# EAGLE design uart2dali_mr3020_3 (EAGLE 6.4)
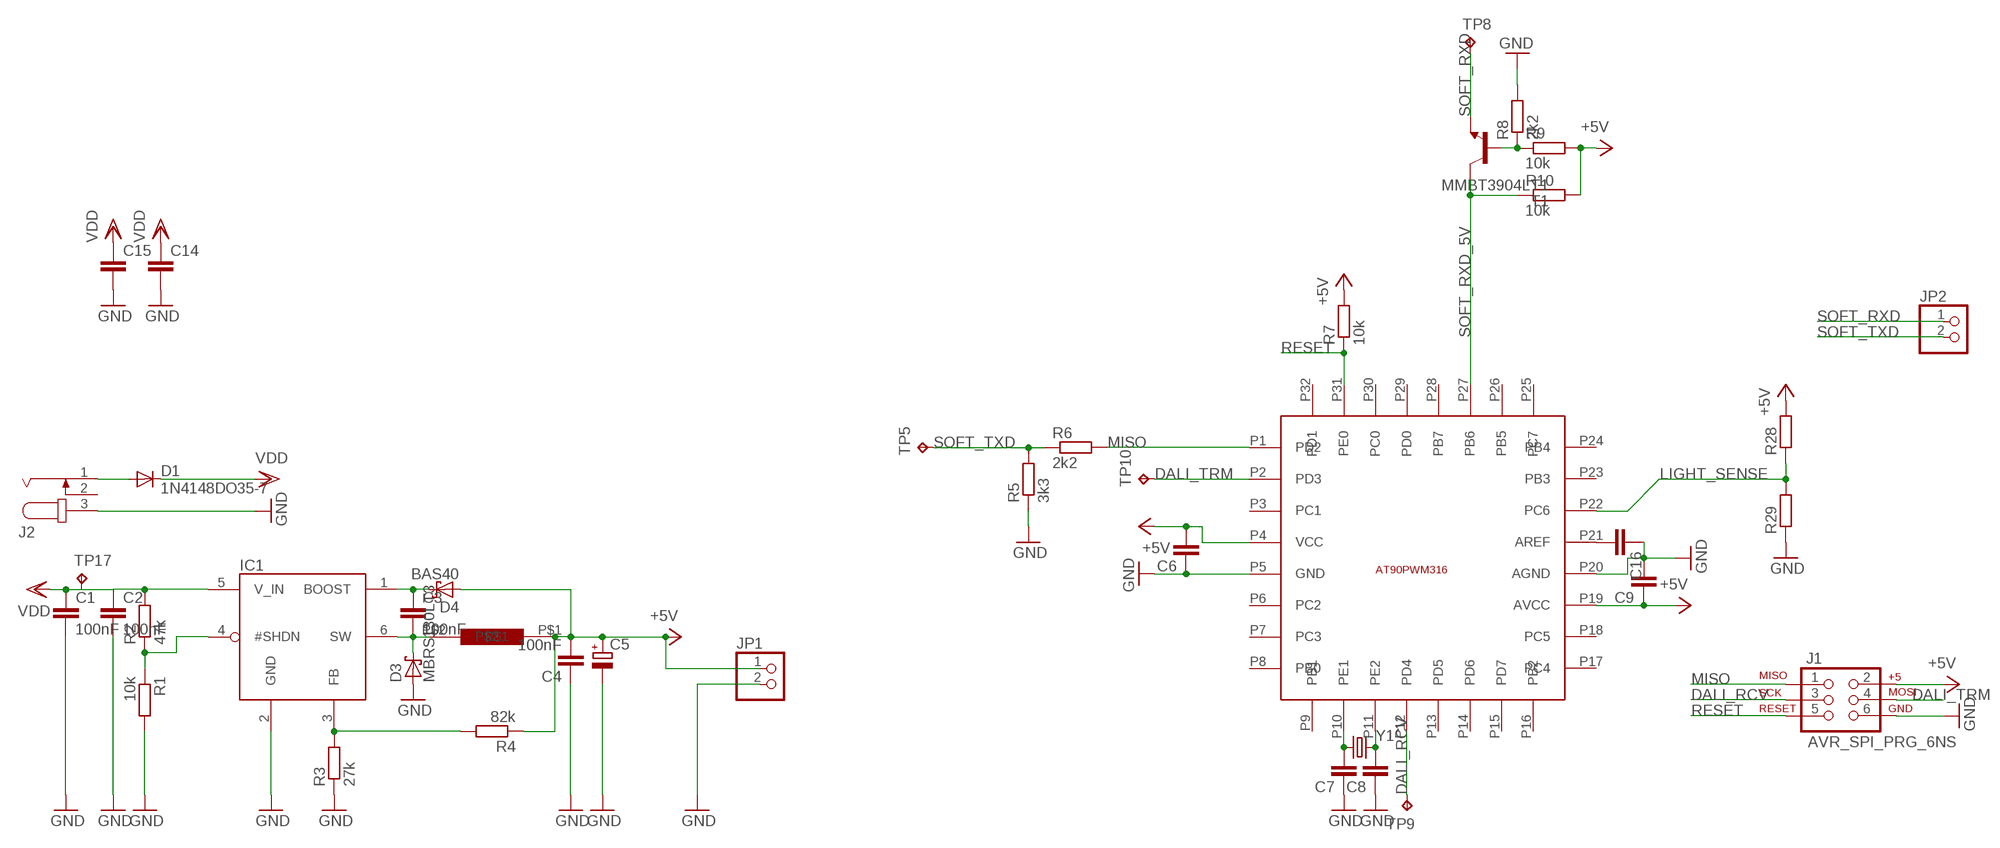
[diagram p0: schematic, sheet 1, part 1 of 2]
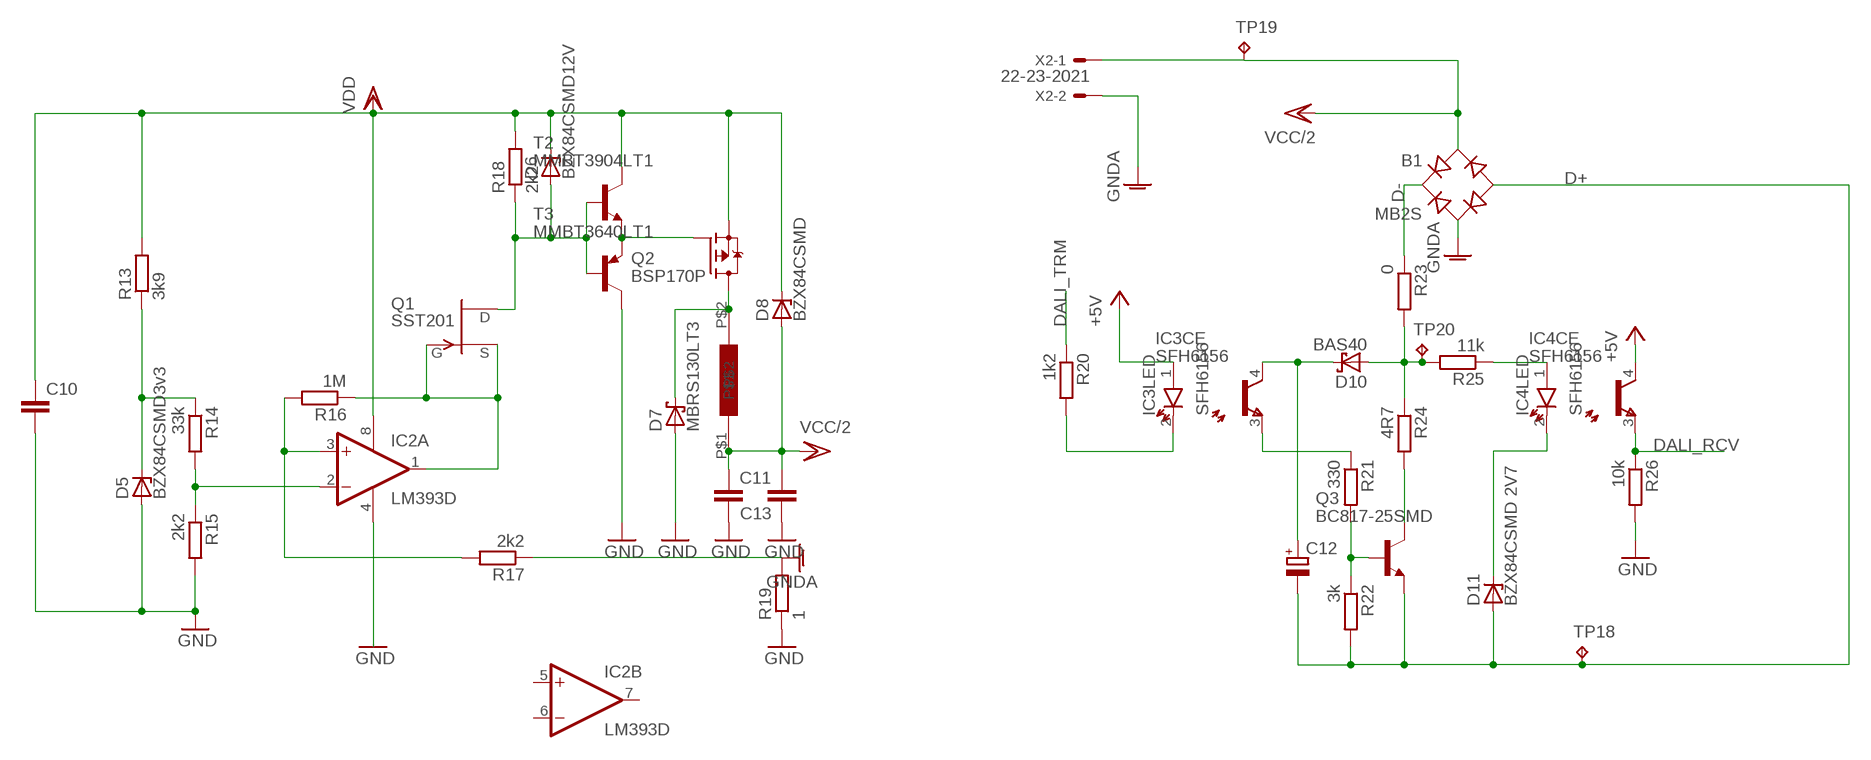
[diagram p1: schematic, sheet 1, part 2 of 2]

## Parts
B1  MB2S  [SOIC-4]
C1  100nF  C-EUC0805  [C0805]
C2  100nF  C-EUC0805  [C0805]
C3  100nF  C-EUC0805  [C0805]
C4  100nF  C-EUC0805  [C0805]
C5  CPOL-EUCT7343  [CT7343]
C6  C-EUC0603  [C0603]
C7  C-EUC0603  [C0603]
C8  C-EUC0603  [C0603]
C9  C-EUC0603  [C0603]
C10  C-EUC0603  [C0603]
C11  C-EUC0805  [C0805]
C12  CPOL-EUCT6032  [CT6032]
C13  C-EUC0805  [C0805]
C14  C-EUC0805  [C0805]
C15  C-EUC0805  [C0805]
C16  C-EUC0603  [C0603]
D1  1N4148DO35-7  [DO35-7]
D3  MBRS130LT3  [SMB]
D4  BAS40  [SOT23]
D5  BZX84CSMD3v3  BZX84CSMD  [TO236]
D6  BZX84CSMD12V  BZX84CSMD  [TO236]
D7  MBRS130LT3  [SMB]
D8  BZX84CSMD  [TO236]
D10  BAS40  [SOT23]
D11  BZX84CSMD 2V7  BZX84CSMD  [TO236]
IC1  LT1933ES6  [SOT23-6]
IC2  LM393D  [SO08]
IC3  SFH6156  [SFH]
IC4  SFH6156  [SFH]
J1  AVR_SPI_PRG_6NS  [2X3-NS]
J2  JACK-PLUG1  [SPC4078]
JP1  PINHD-1X2  [1X02]
JP2  PINHD-1X2  [1X02]
Q1  SST201  [SOT23]
Q2  BSP170P  [SOT223]
Q3  BC817-25SMD  [SOT23-BEC]
R1  10k  R-EU_R0603  [R0603]
R2  47k  R-EU_R0603  [R0603]
R3  27k  R-EU_R0603  [R0603]
R4  82k  R-EU_R0603  [R0603]
R5  3k3  R-EU_R0603  [R0603]
R6  2k2  R-EU_R0603  [R0603]
R7  10k  R-EU_R0603  [R0603]
R8  2k2  R-EU_R0603  [R0603]
R9  10k  R-EU_R0603  [R0603]
R10  10k  R-EU_R0603  [R0603]
R13  3k9  R-EU_R0603  [R0603]
R14  33k  R-EU_R0603  [R0603]
R15  2k2  R-EU_R0603  [R0603]
R16  1M  R-EU_R0603  [R0603]
R17  2k2  R-EU_R0603  [R0603]
R18  2k2  R-EU_R0603  [R0603]
R19  1  R-EU_R0603  [R0603]
R20  1k2  R-EU_R0603  [R0603]
R21  330  R-EU_R0603  [R0603]
R22  3k  R-EU_R0603  [R0603]
R23  0  R-EU_R0603  [R0603]
R24  4R7  R-EU_R0603  [R0603]
R25  11k  R-EU_R0603  [R0603]
R26  10k  R-EU_R0603  [R0603]
R28  R-EU_0207/2V  [0207/2V]
R29  R-EU_R0603  [R0603]
T1  MMBT3904LT1  MMBT3904LT1-NPN-SOT23-BEC  [SOT23-BEC]
T2  MMBT3904LT1  MMBT3904LT1-NPN-SOT23-BEC  [SOT23-BEC]
T3  MMBT3640LT1  MMBT3640LT1-PNP-SOT23-BEC  [SOT23-BEC]
TP5  TPB1,27  [B1,27]
TP8  TPB1,27  [B1,27]
TP9  TPB1,27  [B1,27]
TP10  TPB1,27  [B1,27]
TP17  TPB1,27  [B1,27]
TP18  TPB1,27  [B1,27]
TP19  TPB1,27  [B1,27]
TP20  TPB1,27  [B1,27]
U$1  KMP_2330_UNSHIELDED 33uH  KMP_2330_UNSHIELDED  [KMP_2330_UNSHIELDED]
U$2  AT90PWM316  [QFN32_7MM]
U$3  SDR0805  [SDR0805]
X2  22-23-2021  [22-23-2021]
Y1  CRYSTALTXC-7A  [CRYSTAL-TXC-7A]

## Nets
+5V: C4.2 C5.+ C6.2 C9.1 D4.1(A) IC3.1(LED:A) IC4.4(CE:C) J1.2 JP1.1 R4.1 R7.2 R9.2 R10.2 R28.2 U$1.P$1 U$2.P4(VCC) U$2.P19(AVCC)
D+: B1.- C12.- D11.A Q3.E R22.2 TP18.TP
D-: B1.+ R23.1
DALI_RCV: J1.3 TP9.TP U$2.P12(PD4)
DALI_TRM: J1.4 R20.1 TP10.TP U$2.P2(PD3)
GND: C1.2 C2.2 C4.1 C5.- C6.1 C7.1 C8.1 C9.2 C10.2 C11.2 C13.1 C14.2 C15.2 C16.1 D3.A D5.A D7.A IC1.2(GND) IC2.4(P:V-) J1.6 J2.3 JP1.2 R1.2 R3.1 R5.1 R8.2 R15.2 R19.1 R26.2 R29.1 T3.C U$2.P5(GND) U$2.P20(AGND)
GNDA: B1.~2(AC2) R17.1 R19.2 X2.2
LIGHT_SENSE: R28.1 R29.2 U$2.P22(PC6)
MISO: J1.1 R6.2 U$2.P1(PD2)
N$1: IC3.2(LED:K) R20.2
N$2: IC2.2(A:-IN) R14.2 R15.1
N$3: IC1.4(#SHDN) R1.1 R2.1
N$4: C12.+ D10.3(C) IC3.4(CE:C)
N$5: IC3.3(CE:E) R21.1
N$6: Q3.B R21.2 R22.1
N$7: IC4.3(CE:E) R26.1
N$8: C16.2 U$2.P21(AREF)
N$9: D10.1(A) R23.2 R24.1 R25.2 TP20.TP
N$10: Q3.C R24.2
N$11: IC4.1(LED:A) R25.1
N$12: D11.C IC4.2(LED:K)
N$16: C7.2 U$2.P10(PE1) Y1.P$1
N$19: C8.2 U$2.P11(PE2) Y1.P$2
N$20: R8.1 R9.1 T1.B
N$22: IC2.1(A:OUT) Q1.2(S) Q1.3(G) R16.1
N$23: D1.A J2.1
N$24: C3.1 D4.3(C) IC1.1(BOOST)
N$25: C3.2 D3.C IC1.6(SW) U$1.P$2
N$26: D7.C Q2.2(D) Q2.4(D) U$3.P$2
N$31: IC1.3(FB) R3.2 R4.2
N$33: Q2.1(G) T2.E T3.E
N$34: D6.A Q1.1(D) R18.1 T2.B T3.B
N$35: D5.C R13.1 R14.1
N$40: IC2.3(A:+IN) R16.2 R17.2
RESET: J1.5 R7.1 U$2.P31(PE0)
SOFT_RXD: JP2.1 T1.E TP8.TP
SOFT_RXD_5V: R10.1 T1.C U$2.P27(PB6)
SOFT_TXD: JP2.2 R5.2 R6.1 TP5.TP
VCC/2: B1.~1(AC1) C11.1 C13.2 D8.A TP19.TP U$3.P$1 X2.1
VDD: C1.1 C2.1 C10.1 C14.1 C15.1 D1.C D6.C D8.C IC1.5(V_IN) IC2.8(P:V+) Q2.3(S) R2.2 R13.2 R18.2 T2.C TP17.TP
Unconnected: IC2.5(B:+IN) IC2.6(B:-IN) IC2.7(B:OUT) J2.2 U$2.P3(PC1) U$2.P6(PC2) U$2.P7(PC3) U$2.P8(PB0) U$2.P9(PB1) U$2.P13(PD5) U$2.P14(PD6) U$2.P15(PD7) U$2.P16(PB2) U$2.P17(PC4) U$2.P18(PC5) U$2.P23(PB3) U$2.P24(PB4) U$2.P25(PC7) U$2.P26(PB5) U$2.P28(PB7) U$2.P29(PD0) U$2.P30(PC0) U$2.P32(PD1)

## Library data of the parts
B1 = rectifier:MB*S: Bridge Rectifier Source: http://www.fairchildsemi.com/ds/MB/MB6S.pdf
C1-C4 C6-C11 C13-C16 = resistor:C-EU: CAPACITOR, European symbol
C5 C12 = resistor:CPOL-EU: POLARIZED CAPACITOR, European symbol
D1 = diode:1N4148: DIODE high speed (Philips)
D3 D7 = diode:MBRS130LT3: Schottky Power Rectifier Source: http://www.onsemi.com/pub/Collateral/MBRS130LT3-D.PDF
D4 D10 = diode:BAS40: Silicon Schottky Diodes General-purpose diode for high-speed switching
D5 D6 D8 D11 = diode:BZX84CSMD: Z DIODE
IC1 = ltc_swr:LT1933: LT1933 - 600mA, 500kHz Step-Down Switching Regulator in SOT-23 Wide Input Range: 3.6V to 36V 5V at 600mA from 16V to 36V Input 3.3V at 600mA from 12V to 36V Input 5V at 500mA from 6.3V to 36V Input 3.3V at 500mA from 4.5V to 36V Input Fixed Frequency 500kHz Operation Uses Tiny Capacitors and Inductors Soft-Start Internally Compensated Low Shutdown Current: <2µA Output Adjustable Down to 1.25V Low Profile (1mm) SOT-23 (ThinSOT™) and (2mm x 3mm x 0.75mm) 6-Pin DFN Packages
IC2 = linear:LM393: COMPARATOR
IC3 IC4 = optocoupler:SFH6156: 5.3 kV TRIOS High Reliability Optocoupler; MF: VISHAY/TELEFUNKEN; MPN: SFH6156-4T; OC_FARNELL: 1612479; OC_NEWARK: 21H7733
J1 = SparkFun-Connectors:AVR_SPI_PRG_6: AVR ISP 6 Pin This is the reduced ISP connector for AVR programming. Common on Arduino. This footprint will take up less PCB space and can be used with a 10-pin to 6-pin adapter such as SKU: BOB-08508
J2 = con-jack:JACK-PLUG: DC POWER JACK Power Jack, DC, Right Angle, Through Hole, Rated 5A at 16VDC, PC Terminals Distributor: Farnell (www.Farnell.de) Drawing: 84N1161.pdf / 84N1162.pdf Manufacturer: SPC Technology (www.spctechnology.com) Type: SPC4077 / SPC 4078; OC_FARNELL: unknown; OC_NEWARK: unknown
JP1 JP2 = pinhead:PINHD-1X2: PIN HEADER
Q1 = transistor-fet:?20*: TEMIC / Siliconix N-Channel JFET Source: JFET-J201_Siliconix_data.pdf
Q2 = transistor-fet:BSP170P: SIPMOS(R) Small-Signal-Transistor P-Channel, Enhancement mode Source: http://www.infineon.com/upload/Document/BSP170P_Rev2.4.pdf
Q3 = transistor-npn:BC817*: NPN Transistor
R1-R10 R13-R26 R28 R29 = resistor:R-EU_: RESISTOR, European symbol
T1 T2 = transistor:*-NPN-: NPN Transistror BF959 corrected 2008.03.06
T3 = transistor:*-PNP-: PNP Transistror
TP5 TP8-TP10 TP17-TP20 = testpad:TP: Test pad
U$1 = inductor:KMP_2330_UNSHIELDED
U$2 = at90pwm316:AT90PWM316
U$3 = inductor:SDR0805
X2 = con-molex:22-23-2021: .100" (2.54mm) Center Header - 2 Pin; MF: MOLEX; MPN: 22-23-2021; OC_FARNELL: 1462926; OC_NEWARK: 25C3832
Y1 = SparkFun-FreqCtrl:CRYSTAL: Various standard crystals. Proven footprints. Spark Fun Electronics SKU : COM-00534

## Board
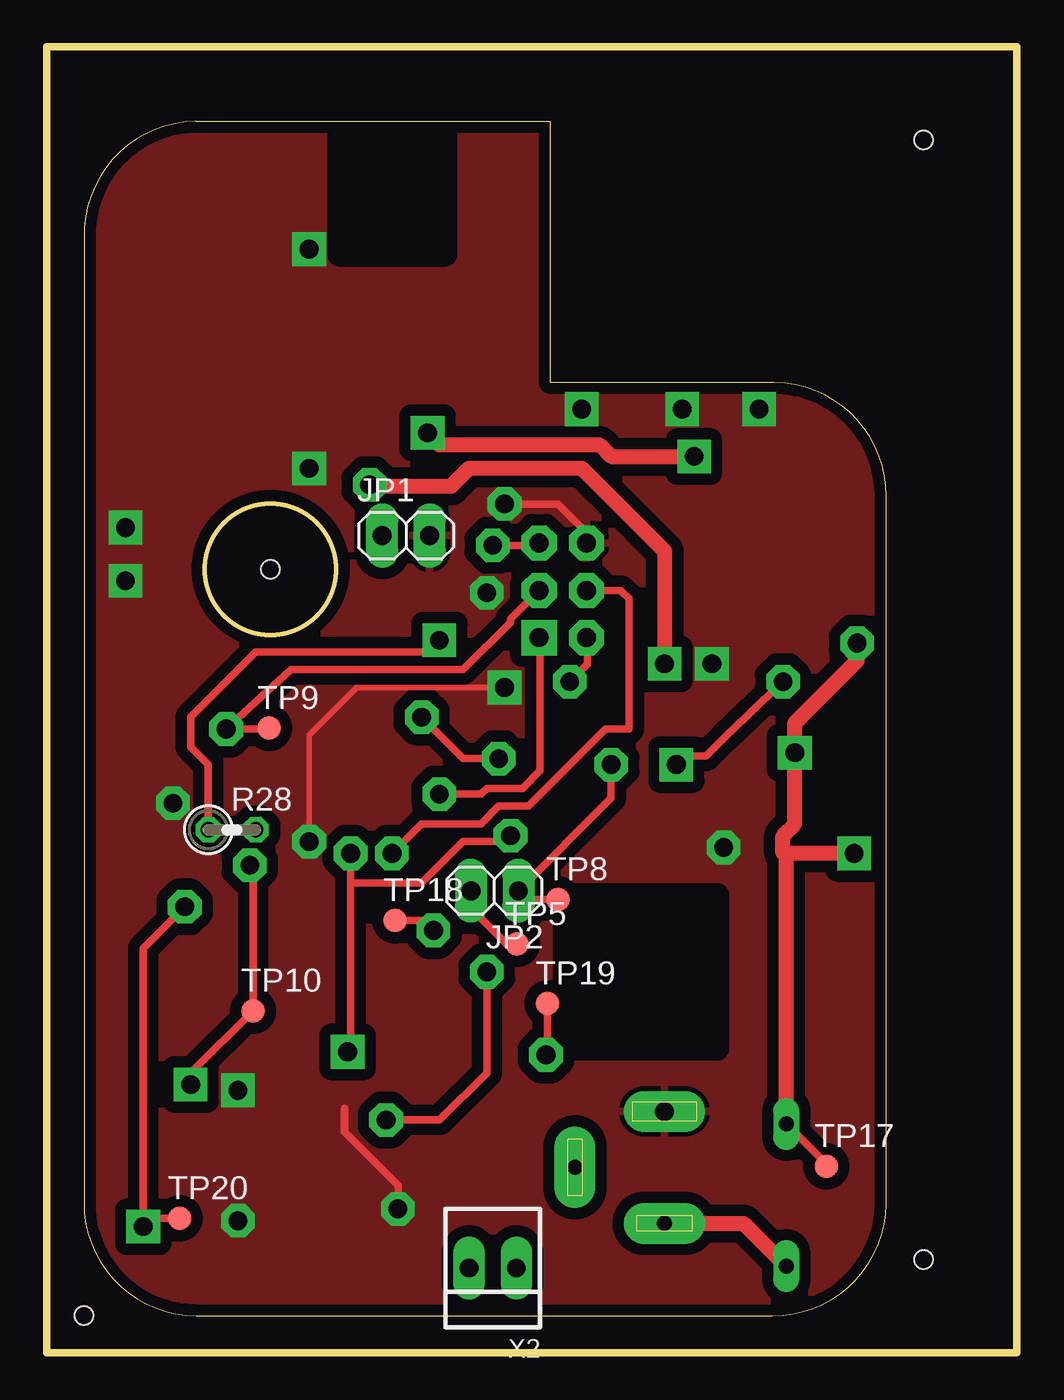
[diagram p2: board, top side]
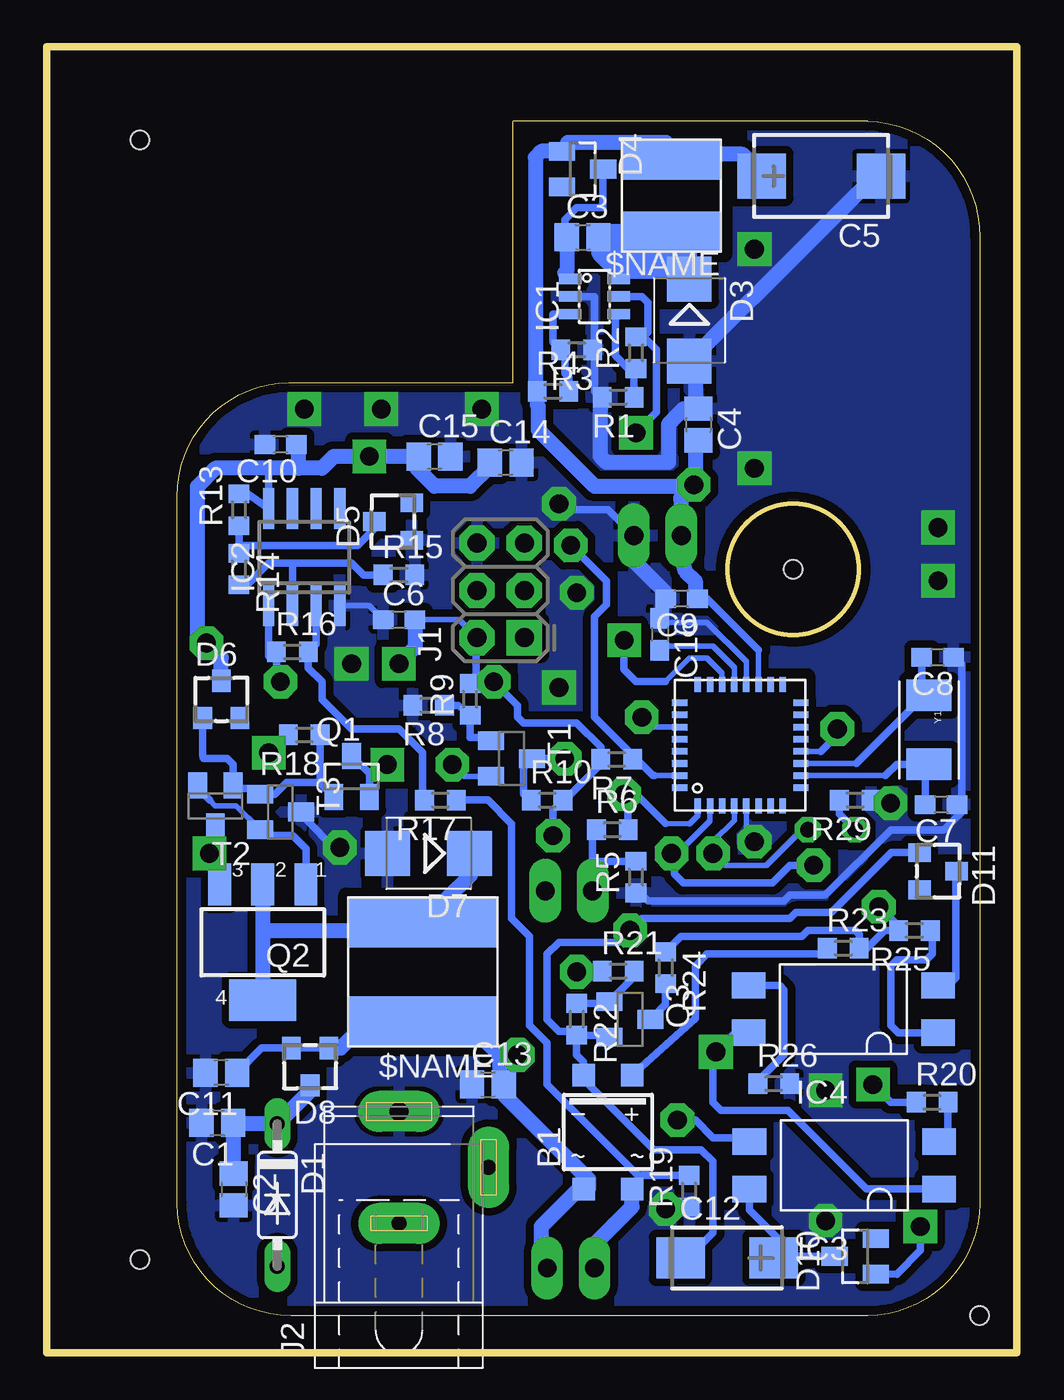
[diagram p3: board, bottom side, seen from below]

Size 52 x 70 mm. Coordinates in mm from the lower left corner, seen from the top.
Outline: 8,66 arc90 2,59.8 2,8 arc90 8,2 38.9,2 arc90 45,8 45,45.9 arc90 39,52 27,52 27,66 8,66
Outline: 0,0 52,0 52,70 0,70 0,0
Outline: circle at 12,42 radius 3.5
Copper layers (1*16): Top 0.035mm / dielectric 1.5mm / Bottom 0.035mm
Design rules "default *": minimum track width 10mil, minimum drill 24mil, track to track 12mil, track to pad 12mil, pad to pad 10mil, via to via 8mil, smd to smd 0mil, copper to edge 20mil, drill to drill 8mil, minimum pad ring 10mil, minimum via ring 8mil, stop-mask expansion 4mil, vias tented up to drill 0mil, thermal gap 10mil
Holes 1 mm at 47,65 47,5 12,42 2,2
bKeepout: area 2,46 to 15,60
tRestrict: area 27.7,16.3 to 36,24.5; area 15.7,58.8 to 21.4,65.8
bRestrict: area 11.2,29 to 18.5,36.3; area 27.7,16.3 to 36,24.5; area 15.7,58.8 to 21.4,65.8; area 30.6,24.9 to 32.5,28.7

### Footprints (pad centres in the part's own frame; a part is rotated, then mirrored left to right if it is on the bottom)
SOIC-4 = smd 1.2 x 1.2: + 1.3,3.05; - -1.3,3.05; ~1 -1.3,-3.05; ~2 1.3,-3.05
C0805 = smd 1.3 x 1.5: 1 -0.85,0; 2 0.85,0
CT7343 = smd 2.6 x 2.4: + 3.2,0; - -3.2,0
C0603 = smd 1.1 x 1: 1 -0.85,0; 2 0.85,0
CT6032 = smd 2.6 x 2.2: + 2.5,0; - -2.5,0
DO35-7 = drill 0.813 long: A 3.81,0; C -3.81,0
SMB = smd 2.4 x 2.4: A 2.2,0; C -2.2,0
SOT23 = smd 1 x 1.4: 1 -0.95,-1.1; 2 0.95,-1.1; 3 0,1.1
TO236 = smd 1 x 1.2: A -1,-1; C 0,1; NC 1,-1
SOT23-6 = smd 0.55 x 1.2: 1 -0.95,-1.3; 2 0,-1.3; 3 0.95,-1.3; 4 0.95,1.3; 5 0,1.3; 6 -0.95,1.3
SO08 = smd 0.6 x 2.2: 1 -1.905,-2.6; 2 -0.635,-2.6; 3 0.635,-2.6; 4 1.905,-2.6; 5 1.905,2.6; 6 0.635,2.6; 7 -0.635,2.6; 8 -1.905,2.6
SFH = smd 1.4 x 1.8: 1 1.27,5.08; 2 -1.27,5.08; 3 -1.27,-5.08; 4 1.27,-5.08
2X3-NS = drill 1.016 pad 1.88 square: 1 -2.54,-1.27 | drill 1.016 pad 1.88 octagon: 2 -2.54,1.27; 3 0,-1.27; 4 0,1.27; 5 2.54,-1.27; 6 2.54,1.27
SPC4078 = drill 0.8 pad 2.184 long: 1 -3,0; 2 0,-4.8 | drill 1 pad 2.184 long: 3 3,0
1X02 = drill 1.016 long: 1 -1.27,0; 2 1.27,0
SOT223 = smd 1.219 x 2.235: 1 -2.311,-3.099; 2 0,-3.099; 3 2.311,-3.099 | smd 3.6 x 2.2: 4 0,3.099
SOT23-BEC = smd 1 x 1.4: B -0.95,-1.1; C 0,1.1; E 0.95,-1.1
R0603 = smd 1 x 1.1: 1 -0.85,0; 2 0.85,0
0207/2V = drill 0.813 octagon: 1 -1.27,0; 2 1.27,0
B1,27 = smd 1.27 x 1.27: TP 0,0
KMP_2330_UNSHIELDED = smd 5.3 x 2.15: P$1 0,-1.925; P$2 0,1.925
QFN32_7MM = smd 0.813 x 0.35: P1 -3.25,2.275; P2 -3.25,1.625; P3 -3.25,0.975; P4 -3.25,0.325; P5 -3.25,-0.325; P6 -3.25,-0.975; P7 -3.25,-1.625; P8 -3.25,-2.275; P17 3.25,-2.275; P18 3.25,-1.625; P19 3.25,-0.975; P20 3.25,-0.325; P21 3.25,0.325; P22 3.25,0.975; P23 3.25,1.625; P24 3.25,2.275 | smd 0.35 x 0.813: P9 -2.275,-3.25; P10 -1.625,-3.25; P11 -0.975,-3.25; P12 -0.325,-3.25; P13 0.325,-3.25; P14 0.975,-3.25; P15 1.625,-3.25; P16 2.275,-3.25; P25 2.275,3.25; P26 1.625,3.25; P27 0.975,3.25; P28 0.325,3.25; P29 -0.325,3.25; P30 -0.975,3.25; P31 -1.625,3.25; P32 -2.275,3.25
SDR0805 = smd 8 x 2.7: P$1 0,2.65; P$2 0,-2.65
22-23-2021 = drill 1 long: 1 -1.27,0; 2 1.27,0
CRYSTAL-TXC-7A = smd 1.7 x 2.4: P$1 1.85,0; P$2 -1.85,0

### Placement (x,y rotation side)
B1  21.92,11.83 0 bottom
C1  42.85,12.31 180 bottom
C2  41.97,8.76 270 bottom
C3  23.27,59.78 0 bottom
C4  17.06,49.75 270 bottom
C5  10.48,63.06 180 bottom
C6  33.12,39.29 0 bottom
C7  4.07,29.38 180 bottom
C8  4.25,37.28 180 bottom
C9  17.97,40.42 180 bottom
C10  39.47,48.67 180 bottom
C11  42.64,15.02 180 bottom
C12  15.53,5.09 0 bottom
C13  28.35,14.38 0 bottom
C14  27.4,47.72 0 bottom
C15  31.21,48.04 0 bottom
C16  19.14,38.51 270 bottom
D1  39.65,8.46 270 bottom
D3  17.56,55.34 270 bottom
D4  23.27,63.44 270 bottom
D5  33.43,44.55 90 bottom
D6  42.64,35.02 0 bottom
D7  31.53,26.77 180 bottom
D8  37.88,15.34 180 bottom
D10  8.67,5.17 90 bottom
D11  4.22,25.81 270 bottom
IC1  22.64,56.61 270 bottom
IC2  38.2,42.64 0 bottom
IC3  9.25,10.05 270 bottom
IC4  9.3,18.43 270 bottom
J1  27.67,40.86 90 bottom
J2  33.11,9.94 90 bottom
JP1  19.25,43.8 0 top
JP2  24.01,24.76 180 top
Q1  35.66,30.89 0 bottom
Q2  40.42,22 180 bottom
Q3  20.73,17.88 270 bottom
R1  21.37,51.21 180 bottom
R2  20.41,53.59 90 bottom
R3  23.59,53.75 180 bottom
R4  24.86,51.53 0 bottom
R5  20.41,25.5 90 bottom
R6  21.68,28.04 0 bottom
R7  21.45,31.8 180 bottom
R8  31.53,34.7 180 bottom
R9  29.3,35.02 90 bottom
R10  25.18,29.62 0 bottom
R13  41.69,45.18 90 bottom
R14  41.69,42.01 270 bottom
R15  33.11,41.69 0 bottom
R16  38.83,37.56 0 bottom
R17  30.89,29.62 180 bottom
R18  38.2,33.11 180 bottom
R19  17.56,8.67 90 bottom
R20  4.54,13.43 0 bottom
R21  21.37,20.46 0 bottom
R22  23.59,17.88 270 bottom
R23  9.3,21.68 0 bottom
R24  18.83,20.64 270 bottom
R25  5.49,22.64 180 bottom
R26  13.03,14.43 0 bottom
R28  9.94,28.04 0 top
R29  8.67,29.62 180 bottom
T1  27.08,31.84 270 bottom
T2  42.96,29.3 180 bottom
T3  39.47,28.99 270 bottom
TP5  25.21,21.9 0 top
TP8  27.41,24.3 0 top
TP9  11.94,33.48 0 top
TP10  11.06,18.33 0 top
TP17  41.8,10 0 top
TP18  18.68,23.18 0 top
TP19  26.85,18.72 0 top
TP20  7.13,7.21 0 top
U$1  18.51,62.01 180 bottom
U$2  14.82,32.56 90 bottom
U$3  31.84,20.41 180 bottom
X2  23.91,4.54 180 top
Y1  4.71,33.39 270 bottom

### Tracks (layer width: path | path; a pad name or v marks a point on that pad's centre or on a via)
+5V  (via drill 1)
  Top 0.406: 16.29,25.18 20.1,25.18 22.32,27.4 24.54,27.4 v24.86,27.72 | 16.29,25.18 v16.29,26.77 | 16.29,25.18 16.29,16.29 v16.13,16.13 | v28.04,35.97 28.99,36.92 28.99,38.2 28.94,38.24 J1.2
  Top 0.813: v33.11,36.92 33.11,42.96 28.67,47.4 22.64,47.4 21.68,46.45 17.38,46.45 v17.31,46.52
  Bottom 0.305: U$2.P19 13.85,37.66 | U$2.P4 15.15,28.54 16.29,27.4 v16.29,26.77 | 16.26,26.48 v16.29,26.77 | R28.2 11.53,28.04 13.43,26.13 15.65,26.13 v16.29,26.77 | C6.2 29.91,39.29 J1.2
  Bottom 0.406: C9.1 16.61,40.42 13.85,37.66 13.86,37.66 | IC3.1 8.06,8.78 12.28,13 15.86,13 16.29,13.43 16.29,15.97 v16.13,16.13 15.1,17.16 IC4.4 | 28.94,38.15 28.99,38.2 28.99,36.19 R9.2 28.04,35.87 v28.04,35.97 26.77,34.7 26.77,34.07 26.45,33.75 23.59,33.75 22.3,32.46 R7.2 22.05,31.8 24.01,29.84 R10.2 24.86,29.09 v24.86,27.72
  Bottom 0.813: 17.87,63.99 18.8,64.85 24.06,64.85 D4.1 25.49,64.39 25.81,64.07 25.81,51.63 R4.1 25.71,50.84 25.65,50.74 25.65,49.47 22.64,46.45 17.38,46.45 | 17.87,63.99 U$1.P$1 | C5.+ 14.13,63.66 14.7,64.23 17.63,64.23 17.87,63.99 | C4.2 17.24,48.9 17.24,46.59 v17.31,46.52 17.38,46.45 | 17.38,46.45 18.02,45.81 18.02,45.73 JP1.1 17.88,43.69 17.88,42.23 17.78,41.91 17.24,41.37 17.24,40.54 C9.1 | v33.11,36.92 32.8,37.28 32.27,37.81 C6.2
D+  (via drill 1)
  Top 0.406: TP18.TP 20.19,23.18 v20.73,22.64
  Bottom 0.406: C12.- 17.64,5.09 16.29,6.45 16.29,10.26 16.92,10.89 19.46,10.89 22.95,14.38 22.95,14.82 B1.- 23.22,15.6 23.59,15.97 R22.2 | R22.2 21.93,17.02 Q3.E | D11.A 6.71,26.81 9.94,23.59 11.84,23.59 12.16,23.27 20.1,23.27 v20.73,22.64 21.37,22 24.54,22 25.18,21.37 25.18,17.88 24.54,17.24 23.8,17.24 R22.2
D-
  Bottom 0.406: R23.1 10.57,21.37 16.61,21.37 17.24,20.73 17.24,17.94 B1.+
DALI_RCV  (via drill 1)
  Top 0.406: TP9.TP 11.66,33.43 v9.62,33.43 13.11,36.61 22.32,36.61 24.86,39.15 24.86,39.32 J1.3
  Bottom 0.305: U$2.P12 10.5,32.23
  Bottom 0.406: v9.62,33.43 9.62,33.11 10.5,32.23
DALI_TRM  (via drill 1)
  Top 0.406: 29.81,40.86 J1.4 30.77,40.86 31.21,40.42 31.21,33.43 29.94,33.43 25.81,29.3 24.23,29.3 23.27,28.35 20.1,28.35 v18.51,26.77 | v7.71,14.38 7.71,15.01 TP10.TP 11.07,25.95 v10.89,26.13
  Bottom 0.305: U$2.P2 16.45,28.51 18.35,26.61
  Bottom 0.406: R20.1 6.76,13.43 v7.71,14.38 | v10.89,26.13 12.16,26.13 13.11,25.18 17.88,25.18 18.35,25.66 18.35,26.61 v18.51,26.77
GND  (via drill 1)
  Top 0.305: v14.06,27.4 14.06,33.11 16.61,35.66 v24.54,35.66
  Top 0.406: 15.97,13.11 15.97,11.84 18.83,8.98 v18.83,7.71 | J1.6 28.94,43.96 27.4,45.5 v24.54,45.5
  Bottom 0.305: U$2.P20 14.5,37.04 16.61,39.15 18.93,39.15 | U$2.P5 14.5,27.83 v14.06,27.4 | IC2.4 34.72,40.04 C6.1
  Bottom 0.406: IC1.2 22.64,56.61 22.64,53.85 R3.1 22.64,53.65 22.64,51.53 22.22,51.11 R1.2 | C8.1 3.3,37.28 2.95,36.92 2.95,29.65 C7.1 2.95,29.12 2.95,28.99 3.91,28.04 6.76,28.04 10.26,24.54 12.16,24.54 12.48,24.23 19.78,24.23 20.1,24.54 R5.1 | 17.24,50.58 17.36,50.58 C4.1 | v24.54,45.5 24.23,45.5 23.91,45.18 21.91,45.18 JP1.2 | T3.C 38.05,28.52 36.61,27.08 v36.29,27.08 | C9.2 18.93,40.31 C16.1 18.93,39.15 | R19.1 18.73,7.82 v18.83,7.71
  Bottom 0.813: D3.A 15.02,55.68 13.43,57.24 8.03,62.64 7.7,62.64 C5.- | D3.A 17.24,52.8 17.24,50.77 C4.1 | D3.A 17.24,52.48 17.24,50.58 17.88,50.58 18.67,49.78 18.67,47.72 22,47.72 22.32,48.04 22.32,50.48 R1.2 | C9.2 18.83,40.73 20.41,42.32 20.41,43.69 JP1.2
  other vias: 28.67,50.58 34.07,50.58 38.2,50.58 4.22,41.37 14.06,47.4 35.66,36.92 14.06,59.15 4.22,44.23 23.59,40.73 6.76,29.46 10.26,7.08 10.26,14.06
  pour Top (isolate 0.61): 2,59.78 2,61.69 6.13,65.82 8.03,65.82 27.08,65.82 27.08,52.16 39.47,52.16 39.47,51.85 42.01,51.53 45.18,48.35 45.18,46.13 45.18,7.71 45.18,6.13 41.69,2.63 39.47,2 7.71,2 4.86,2 2.32,4.54 2,7.71
  pour Bottom (isolate 0.406): 2,7.71 2,61.69 6.13,65.82 27.08,65.82 27.08,52.16 39.15,52.16 39.47,51.85 42.01,51.53 44.86,48.67 44.86,46.45 45.18,46.13 45.18,7.71 44.55,5.17 41.37,2 4.86,2 2.32,4.54
GNDA
  Bottom 0.406: B1.~2 20.31,9.08 20.31,9.52 | 20.31,9.52 25.18,14.38 25.18,16.61 26.13,17.56 26.13,22.32 27.08,23.27 27.08,28.35 28.35,29.62 30.26,29.62 29.94,29.3 R17.1 | R19.2 20.31,9.52
  Bottom 0.813: X2.2 22.64,5.81 20.62,7.83 B1.~2
LIGHT_SENSE  (via drill 1)
  Top 0.406: v21.05,38.2 20.41,37.56 11.21,37.56 7.71,34.07 7.71,32.48 8.67,31.53 R28.1
  Bottom 0.305: 18.83,35.97 17.56,37.24 16.61,37.24 15.8,36.44 U$2.P22
  Bottom 0.406: R29.2 9.52,28.89 R28.1 | v21.05,38.2 21.05,36.61 20.41,35.97 18.83,35.97
MISO  (via drill 1)
  Top 0.406: v21.05,29.94 23.27,29.94 23.59,30.26 25.5,30.26 26.45,31.21 26.45,38.05 J1.1
  Bottom 0.305: U$2.P1 17.1,28.81 17.56,28.35 18.83,28.36
  Bottom 0.406: 18.83,28.36 20.41,29.94 v21.05,29.94 20.84,29.94 R6.2
N$1
  Bottom 0.406: R20.2 3.69,11.8 IC3.2
N$2
  Bottom 0.406: R14.2 41.47,41.16 41.37,41.05 40.1,42.32 38.83,42.32 | 38.83,42.32 IC2.2 | R15.1 35.02,41.69 35.66,42.32 38.83,42.32
N$3
  Bottom 0.406: R1.1 20.52,52.69 R2.1 20.84,52.74 21.53,53.44 21.53,55.63 IC1.4
N$4
  Bottom 0.406: IC3.4 14.34,7.67 12.79,6.13 12.79,5.33 C12.+ 12.95,5.17 D10.3
N$5  (via drill 1)
  Top 0.406: v23.59,20.41 23.59,15.02 21.05,12.48 v18.19,12.48
  Bottom 0.406: R21.1 22.27,20.46 v23.59,20.41 | v18.19,12.48 17.24,12.48 16.29,11.53 14.86,11.53 IC3.3
N$6
  Bottom 0.406: R21.2 20.52,20.14 Q3.B 21.93,18.73 R22.1
N$7
  Bottom 0.406: IC4.3 12.71,19.7 12.48,19.46 12.48,15.97 13.88,14.56 R26.1
N$8
  Bottom 0.305: U$2.P21 15.15,36.74 16.29,37.88 18.73,37.88
  Bottom 0.406: 18.73,37.88 C16.2
N$9  (via drill 1)
  Top 0.406: v7.4,23.91 5.17,21.68 v5.17,6.76 5.62,7.21 TP20.TP
  Bottom 0.406: D10.1 6.45,4.22 5.17,5.5 v5.17,6.76 | v7.4,23.91 6.45,22.95 6.45,22.74 R25.2 7.08,22.64 8.03,21.68 R23.2 8.45,22.42 8.67,22.64 11.21,22.64 11.53,22.32 17.99,22.32 R24.1
N$10
  Bottom 0.406: R24.2 18.83,18.68 Q3.C
N$11
  Bottom 0.406: IC4.1 6.36,17.16 6.76,17.56 6.76,20.73 6.45,21.05 4.86,21.05 4.54,21.37 4.54,22.54 R25.1
N$12
  Bottom 0.406: IC4.2 3.67,19.7 3.27,20.1 3.27,25.54 D11.C
N$16
  Bottom 0.305: U$2.P10 7.04,30.93
  Bottom 0.406: 7.04,30.93 6.45,31.53 6.31,31.53 Y1.P$1 4.92,31.34 C7.2
N$19
  Bottom 0.305: U$2.P11 8.61,31.59
  Bottom 0.406: 8.61,31.59 4.96,35.24 Y1.P$2 5.11,35.63 C8.2
N$20
  Bottom 0.406: T1.B 28.04,32.97 29.3,32.97 R9.1 29.94,34.7 R8.1
N$22  (via drill 1)
  Top 0.406: v39.47,35.97 36.29,32.95 35.34,31.99 34.22,31.99 v33.75,31.53
  Bottom 0.406: IC2.1 40.1,37.34 R16.1 39.68,36.19 v39.47,35.97 | Q1.2 34.7,31.04 | 34.7,31.04 Q1.3 | v33.75,31.53 33.9,31.53 34.7,31.04
N$23
  Top 0.813: J2.1 37.35,6.94 D1.A
N$24
  Bottom 0.406: D4.3 22.17,61.37 23.59,61.37 24.23,60.74 24.23,60.32 C3.1 | 24.23,57.88 23.91,57.53 IC1.1
  Bottom 0.813: C3.1 24.12,57.98 24.23,57.88
N$25
  Bottom 0.406: 21.37,57.88 21.05,57.53 IC1.6
  Bottom 0.813: D3.C 17.56,59.47 18.51,60.42 U$1.P$2 22.44,60.08 C3.2 22.42,58.94 21.37,57.88
N$26
  Bottom 0.813: D7.C 29.28,25.58 U$3.P$2 32.27,22.64 40.42,22.64 | Q2.2 40.42,22.64 | 40.42,22.64 Q2.4
N$31
  Bottom 0.406: IC1.3 24.86,55.66 24.86,55.02 24.86,54.17 R3.2 24.23,53.54 24.23,52.48 24.01,52.27 R4.2
N$33
  Bottom 0.305: 43.27,29.62 42.96,29.3 41.83,29.3 T3.E
  Bottom 0.406: T2.E 43.91,30.25 43.27,29.62 | Q2.1 38.11,26.99 38.83,27.72 39.93,27.72 T3.E
N$34
  Bottom 0.406: D6.A 43.64,32.04 43.59,31.84 42.32,31.84 42.01,31.53 T2.B 41.84,30.41 41.69,30.26 40.59,30.25 T3.B 39.78,29.94 39.15,30.57 37.39,30.57 37.34,30.53 | 37.34,30.53 Q1.1 | R18.1 37.34,30.53
N$35
  Bottom 0.406: D5.C 34.43,44.18 35.34,43.27 41.59,43.27 41.64,43.22 | 41.64,43.22 R14.1 | R13.1 41.69,43.27 41.64,43.22
N$40
  Bottom 0.406: IC2.3 37.56,37.98 R16.2 37.98,36.71 37.24,35.97 37.24,35.02 35.66,33.43 33.11,33.43 31.84,32.16 31.84,29.73 R17.2
RESET  (via drill 1)
  Top 0.406: v23.91,43.27 26.53,43.27 J1.5
  Bottom 0.305: U$2.P31 19.41,30.93
  Bottom 0.406: v23.91,43.27 22,41.37 22,40.1 22.64,39.47 22.64,34.07 20.6,32.03 R7.1 20.41,31.84 19.5,30.93 19.41,30.93
SOFT_RXD  (via drill 1)
  Top 0.406: TP8.TP 25.74,24.3 JP2.1 30.26,29.74 v30.26,31.53
  Bottom 0.305: T1.E 29.62,30.89 v30.26,31.53
SOFT_RXD_5V  (via drill 1)
  Top 0.406: v24.23,31.84 22.32,31.84 v20.1,34.07
  Bottom 0.305: U$2.P27 19.88,33.53
  Bottom 0.406: 19.88,33.53 20.1,33.75 v20.1,34.07 | v24.23,31.84 T1.C 26.45,31.38 26.45,29.94 25.91,29.41 R10.1
SOFT_TXD
  Top 0.406: TP5.TP 24.64,21.9 23.27,23.27 23.27,24.19 JP2.2
  Bottom 0.406: R6.1 22.74,28.04 JP2.2 22.74,26.34 R5.2
VCC/2  (via drill 1)
  Top 0.406: TP19.TP 26.85,16.2 v26.77,15.97
  Bottom 0.406: D8.A 40.47,16.34 C11.1 | v26.77,15.97 27.72,15.97
  Bottom 0.813: X2.1 25.5,4.86 25.5,6.76 23.48,8.78 B1.~1 22.95,8.83 22.95,9.3 27.5,13.85 C13.2 27.72,14.6 27.72,15.97 29.51,17.77 U$3.P$1 35.13,17.45 36.24,16.34 D8.A
VDD  (via drill 1)
  Top 0.406: TP17.TP 41.62,10 41.62,10.29 D1.C
  Top 0.813: v20.41,49.31 21.05,48.67 29.62,48.67 30.26,48.04 v34.7,48.04 | v43.43,38.04 43.43,37.08 40.1,33.75 v40.1,32.16 40.1,28.35 39.47,27.72 39.47,26.77 39.78,26.77 | v43.27,26.77 39.78,26.77 | D1.C 39.65,26.63 39.78,26.77
  Bottom 0.406: IC1.5 20.1,56.61 19.78,56.29 19.78,54.7 20.02,54.47 | 20.02,54.47 20.41,54.39 20.31,54.39 R2.2 | 20.36,49.36 19.3,50.42 19.3,53.75 20.02,54.47 | 40.1,47.4 IC2.8 41.21,46.03 R13.2 41.69,45.81 | R18.2 39.05,33.22 v40.1,32.16 | Q2.3 42.73,27.98 T2.C 42.96,28.04 v43.27,26.77 | C10.1 38.51,48.67 | 39.47,12.48 39.47,12.16 39.78,11.84
  Bottom 0.813: 38.51,47.4 37.24,47.4 36.61,48.04 v34.7,48.04 C15.1 32.16,47.94 32.16,47.4 31.21,46.45 29.3,46.45 28.25,47.51 C14.1 | 38.51,47.4 40.1,47.4 42.96,47.4 43.91,46.45 43.91,38.51 v43.43,38.04 42.64,37.24 D6.C | 20.36,49.36 v20.41,49.31 | D1.C 39.47,12.27 39.47,12.16 | D8.C 37.88,14.03 D1.C | D1.C 41.95,12.27 C1.1 41.97,12.29 C2.1 | 38.51,48.67 38.51,47.4
(copper drawn outside any net)
  shapes: Bottom area x2